# Altium project 300w boost converter.PrjPcb
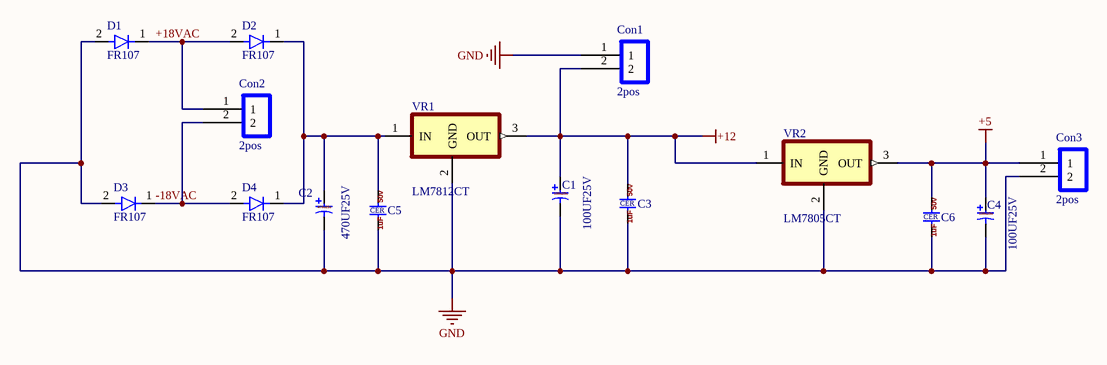
[diagram p0: DC_power.SchDoc]
2 sheets, 54 parts. Net scope: global (net labels, ports and power ports of the same name join across sheets).
Board file: 300W-boost_converter.PcbDoc
Sheets:
  DC_power.SchDoc
  300W Converter_main_HV.SchDoc

## Sheet DC_power.SchDoc
size A; SheetNumber: 1; SheetTotal: 2

### Parts
C1  100UF25V  [CAP LS-1.5mm D4 H5]
C2  470UF25V  [CAP LS-1.5mm D4 H5]
C3  1UFCER  [CAP-CER-2.54]  (value not drawn)
C4  100UF25V  [CAP LS-1.5mm D4 H5]
C5  1UFCER  [CAP-CER-2.54]  (value not drawn)
C6  1UFCER  [CAP-CER-2.54]  (value not drawn)
Con1  2pos  [2POS]
Con2  2pos  [2POS]
Con3  2pos  [2POS]
D1  FR107  [DIOAD1036W78L470D235]
D2  FR107  [DIOAD1036W78L470D235]
D3  FR107  [DIOAD1036W78L470D235]
D4  FR107  [DIOAD1036W78L470D235]
VR1  LM7812CT  [TO254P1054X470X1955-3]
VR2  LM7805CT  [TO254P1054X470X1955-3]

### Nets
+5: C4.1 C6.2 Con3.1 VR2.3(OUT)
+12: C1.1 C3.2 Con1.2 VR1.3(OUT) VR2.1(IN)
GND: C1.2 C2.2 C3.1 C4.2 C5.1 C6.1 Con1.1 Con3.2 D1.2 D3.2 VR1.2(GND) VR2.2(GND)
+18VAC: Con2.1 D1.1 D2.2
-18VAC: Con2.2 D3.1 D4.2
NetC2_1: C2.1 C5.2 D2.1 D4.1 VR1.1(IN)

### Notes on the sheet
- (in symbol 1UFCER) 50v; CER; 1uF
- (in symbol 100UF25V) 100u25v
- (in symbol 470UF50V) 470u50v

### Library data of the parts
C1 C4 = 100UF25V: CAP TH AL: 100U 25V; LCSC Part #: C43351; Unit Price: 0.0057
C2 = 470UF25V: CAP TH AL: 470U 25V; LCSC Part #: C43351; Unit Price: 0.0057
C3 C5 C6 = 1UFCER: CAP: CER 1UF 50V; LCSC Part #: C1848; Unit Price: 0.0104
Con1-Con3 = 2pos: P2.54mm
D1-D4 = FR107: DIODE: GEN 1A 1.0V@1A 1kV DO-41 TH; LCSC Part #: C36138; Unit Price: 0.0313
VR1 = LM7812CT: 1.5-A, 12-V, linear voltage regulator; MF: Texas Instruments; MP: LM7812CT/NOPB; SnapEDA_Link: https://www.snapeda.com/parts/LM7812CT/NOPB/Texas+Instruments/view-part/?ref=snap; Package: TO-220-3 Texas Instruments; Value: *; Check_prices: https://www.snapeda.com/parts/LM7812CT/NOPB/Texas+Instruments/view-part/?ref=eda
VR2 = LM7805CT: 1.5-A,  5-V, linear voltage regulator; MF: Texas Instruments; MP: LM7812CT/NOPB; SnapEDA_Link: https://www.snapeda.com/parts/LM7812CT/NOPB/Texas+Instruments/view-part/?ref=snap; Package: TO-220-3 Texas Instruments; Value: *; Check_prices: https://www.snapeda.com/parts/LM7812CT/NOPB/Texas+Instruments/view-part/?ref=eda

## Sheet 300W Converter_main_HV.SchDoc
size A4; SheetNumber: 2; SheetTotal: 2
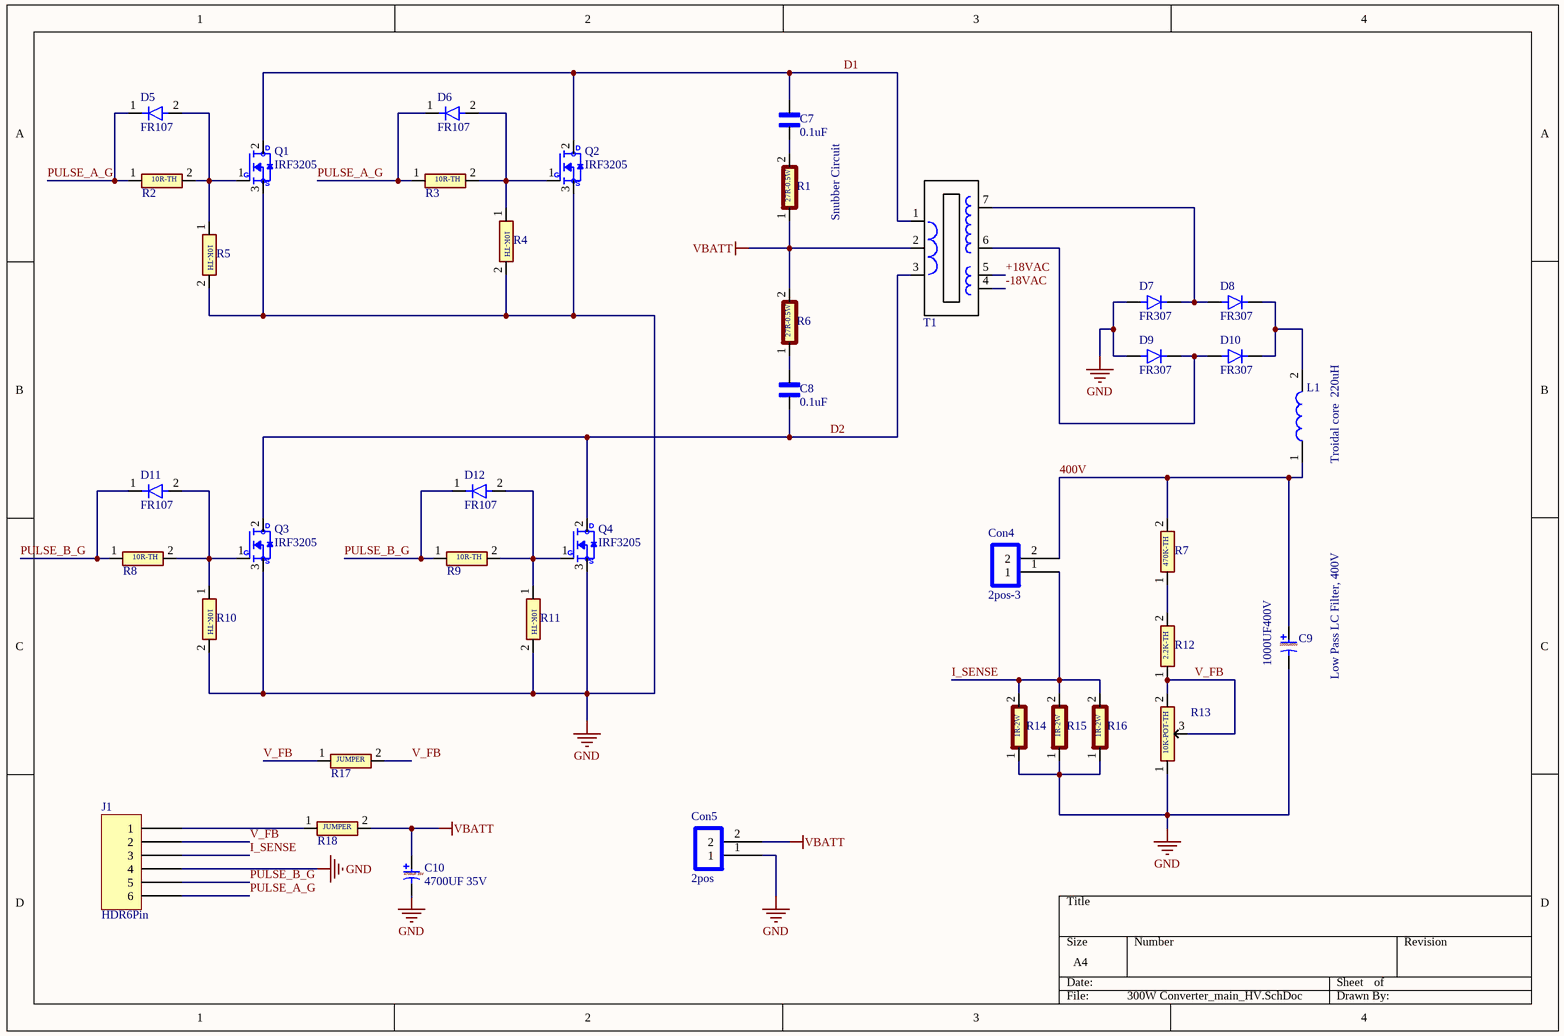
[diagram p1: 300W Converter_main_HV.SchDoc]

### Parts
C7  0.1uF  [CAP-P_Pilm]
C8  0.1uF  [CAP-P_Pilm]
C9  1000UF400V  [CAP-TH_BD35.0-P10.00-D2.3-FD]
C10  4700UF 35V  [CAP-TH_BD18.0-P7.50-D1.2-FD]
Con4  2pos-3  [2POS - 3]
Con5  2pos  [2POS - 3]
D5  FR107  [DIOAD1036W78L470D235]
D6  FR107  [DIOAD1036W78L470D235]
D7  FR307  [DO-27_BD5.3-L8.4-P12.40-D1.3-RD]
D8  FR307  [DO-27_BD5.3-L8.4-P12.40-D1.3-RD]
D9  FR307  [DO-27_BD5.3-L8.4-P12.40-D1.3-RD]
D10  FR307  [DO-27_BD5.3-L8.4-P12.40-D1.3-RD]
D11  FR107  [DIOAD1036W78L470D235]
D12  FR107  [DIOAD1036W78L470D235]
J1  HDR6Pin  [HDR-TH_6P-P2.54-V-F - duplicate]
L1  Troidal core  220uH  [TOROIDAL CORE INDUCTOR]
Q1  IRF3205  [TO-220]
Q2  IRF3205  [TO-220]
Q3  IRF3205  [TO-220]
Q4  IRF3205  [TO-220]
R1  RES-0.5W-27R  [RES_TH 3W]  (value not drawn)
R2  10R  [RES-TH-7mm]  (value not drawn)
R3  10R  [RES-TH-7mm]  (value not drawn)
R4  10K  [RES-TH-7mm]  (value not drawn)
R5  10K  [RES-TH-7mm]  (value not drawn)
R6  RES-0.5W-27R  [RES_TH 3W]  (value not drawn)
R7  470K  [RES-TH-7mm]  (value not drawn)
R8  10R  [RES-TH-7mm]  (value not drawn)
R9  10R  [RES-TH-7mm]  (value not drawn)
R10  10K  [RES-TH-7mm]  (value not drawn)
R11  10K  [RES-TH-7mm]  (value not drawn)
R12  2.2K  [RES-TH-7mm]  (value not drawn)
R13  10K  [TRIM_3296W-1-250]  (value not drawn)
R14  RES-2W-1R  [RES_TH 3W]  (value not drawn)
R15  RES-2W-1R  [RES_TH 3W]  (value not drawn)
R16  RES-2W-1R  [RES_TH 3W]  (value not drawn)
R17  0R  [RES-TH-7mm]  (value not drawn)
R18  0R  [RES-TH-7mm]  (value not drawn)
T1  current transformer  [EE35-FP16]  (value not drawn)

### Nets
GND: C9.2 C10.2 Con5.1 D7.A D9.A J1.4 Q1.3(S) Q2.3(S) Q3.3(S) Q4.3(S) R4.2 R5.2 R10.2 R11.2 R13.1 R14.1 R15.1 R16.1
VBATT: C10.1 Con5.2 R1.1 R6.2 R18.2 T1.2
400V: C9.1 Con4.2 L1.1 R7.2
+18VAC: T1.5
-18VAC: T1.4
D1: C7.2 Q1.2(D) Q2.2(D) T1.1
D2: C8.1 Q3.2(D) Q4.2(D) T1.3
I_SENSE: Con4.1 J1.3 R14.2 R15.2 R16.2
PULSE_A_G: D5.1 D6.1 J1.6 R2.1 R3.1
PULSE_B_G: D11.1 D12.1 J1.5 R8.1 R9.1
V_FB: J1.2 R12.1 R13.2(B) R13.3 R17.1 R17.2
NetC7_1: C7.1 R1.2
NetC8_2: C8.2 R6.1
NetD5_2: D5.2 Q1.1(G) R2.2 R5.1
NetD6_2: D6.2 Q2.1(G) R3.2 R4.1
NetD7_C: D7.C(K) D8.A T1.7
NetD8_C: D8.C(K) D10.C(K) L1.2
NetD9_C: D9.C(K) D10.A T1.6
NetD11_2: D11.2 Q3.1(G) R8.2 R10.1
NetD12_2: D12.2 Q4.1(G) R9.2 R11.1
NetJ1_1: J1.1 R18.1
NetR7_1: R7.1 R12.2

### Notes on the sheet
- Snubber Circuit
- (near C9) Low Pass LC Filter, 400V
- (in symbol 0R) JUMPER
- (in symbol 2.2K) 2.2K-TH
- (in symbol 10K) 10K-TH
- (in symbol 10K POT) 10K-POT-TH
- (in symbol 10R) 10R-TH
- (in symbol 470K) 470K-TH
- (in symbol 1000UF400V) 1000u400v
- (in symbol RES-0.5W-27R) 27R-0.5W
- (in symbol RES-2W-1R) 1R-2W

### Library data of the parts
C7 C8 = 0.1uF_film: Cap Ceramic 0.1uF 100V X7R 10% Radial 2.54mm 125Â°C T/R; MF: KYOCERA AVX; MP: SR201C104KARTR1; SnapEDA_Link: https://www.snapeda.com/parts/SR201C104KARTR1/Kyocera/view-part/?ref=snap; Package: None; Value: *; Check_prices: https://www.snapeda.com/parts/SR201C104KARTR1/Kyocera/view-part/?ref=eda
C9 = 1000UF400V: CAP TH AL: 1000U 400V; LCSC Part #: C43351; Unit Price: 0.0057
C10 = 4700UF 35V: CAP TH AL: 4700UF 35V; LCSC Part #: C43351; Unit Price: 0.0057
Con4 = 2pos-3: P2.54mm
Con5 = 2pos: P2.54mm
D5 D6 D11 D12 = FR107: DIODE: GEN 1A 1.0V@1A 1kV DO-41 TH; LCSC Part #: C36138; Unit Price: 0.0313
D7-D10 = FR307: DIODE: 500ns, 3A, 1000V, Fast Recovery RectifierDO-201AD TH; LCSC Part #: C36138; Unit Price: 0.0313
J1 = HDR6Pin_1: HEADER: 1*6P FEMale
L1 = Inductor: Troidal core  inductor: 220uH
Q1-Q4 = IRF3205: MOSFET: N-CH 55V 110A TO-220; LCSC Part #: C274639; Unit Price: 0.2595
R1 R6 = RES-0.5W-27R: RES: 27 OHM 1% 0.5W TH
R2 R3 R8 R9 = 10R: RES TH: 10R
R4 R5 R10 R11 = 10K: RES TH: 10K
R7 = 470K: RES TH: 470K
R12 = 2.2K: RES TH: 2.2K
R13 = 10K POT: RES TH: 10K POT
R14-R16 = RES-2W-1R: RES: 1 OHM 1% 2W TH
R17 R18 = 0R: RES TH: JUMPER
T1 = EE42 transformer: ferrite core transformer EE42

## Nets that join several sheets
GND: DC_power (12 pins), 300W Converter_main_HV (18 pins)
+18VAC: DC_power (Con2.1 D1.1 D2.2), 300W Converter_main_HV (T1.5)
-18VAC: DC_power (Con2.2 D3.1 D4.2), 300W Converter_main_HV (T1.4)